# EAGLE design blinkmusb_b0 (EAGLE 5.11)
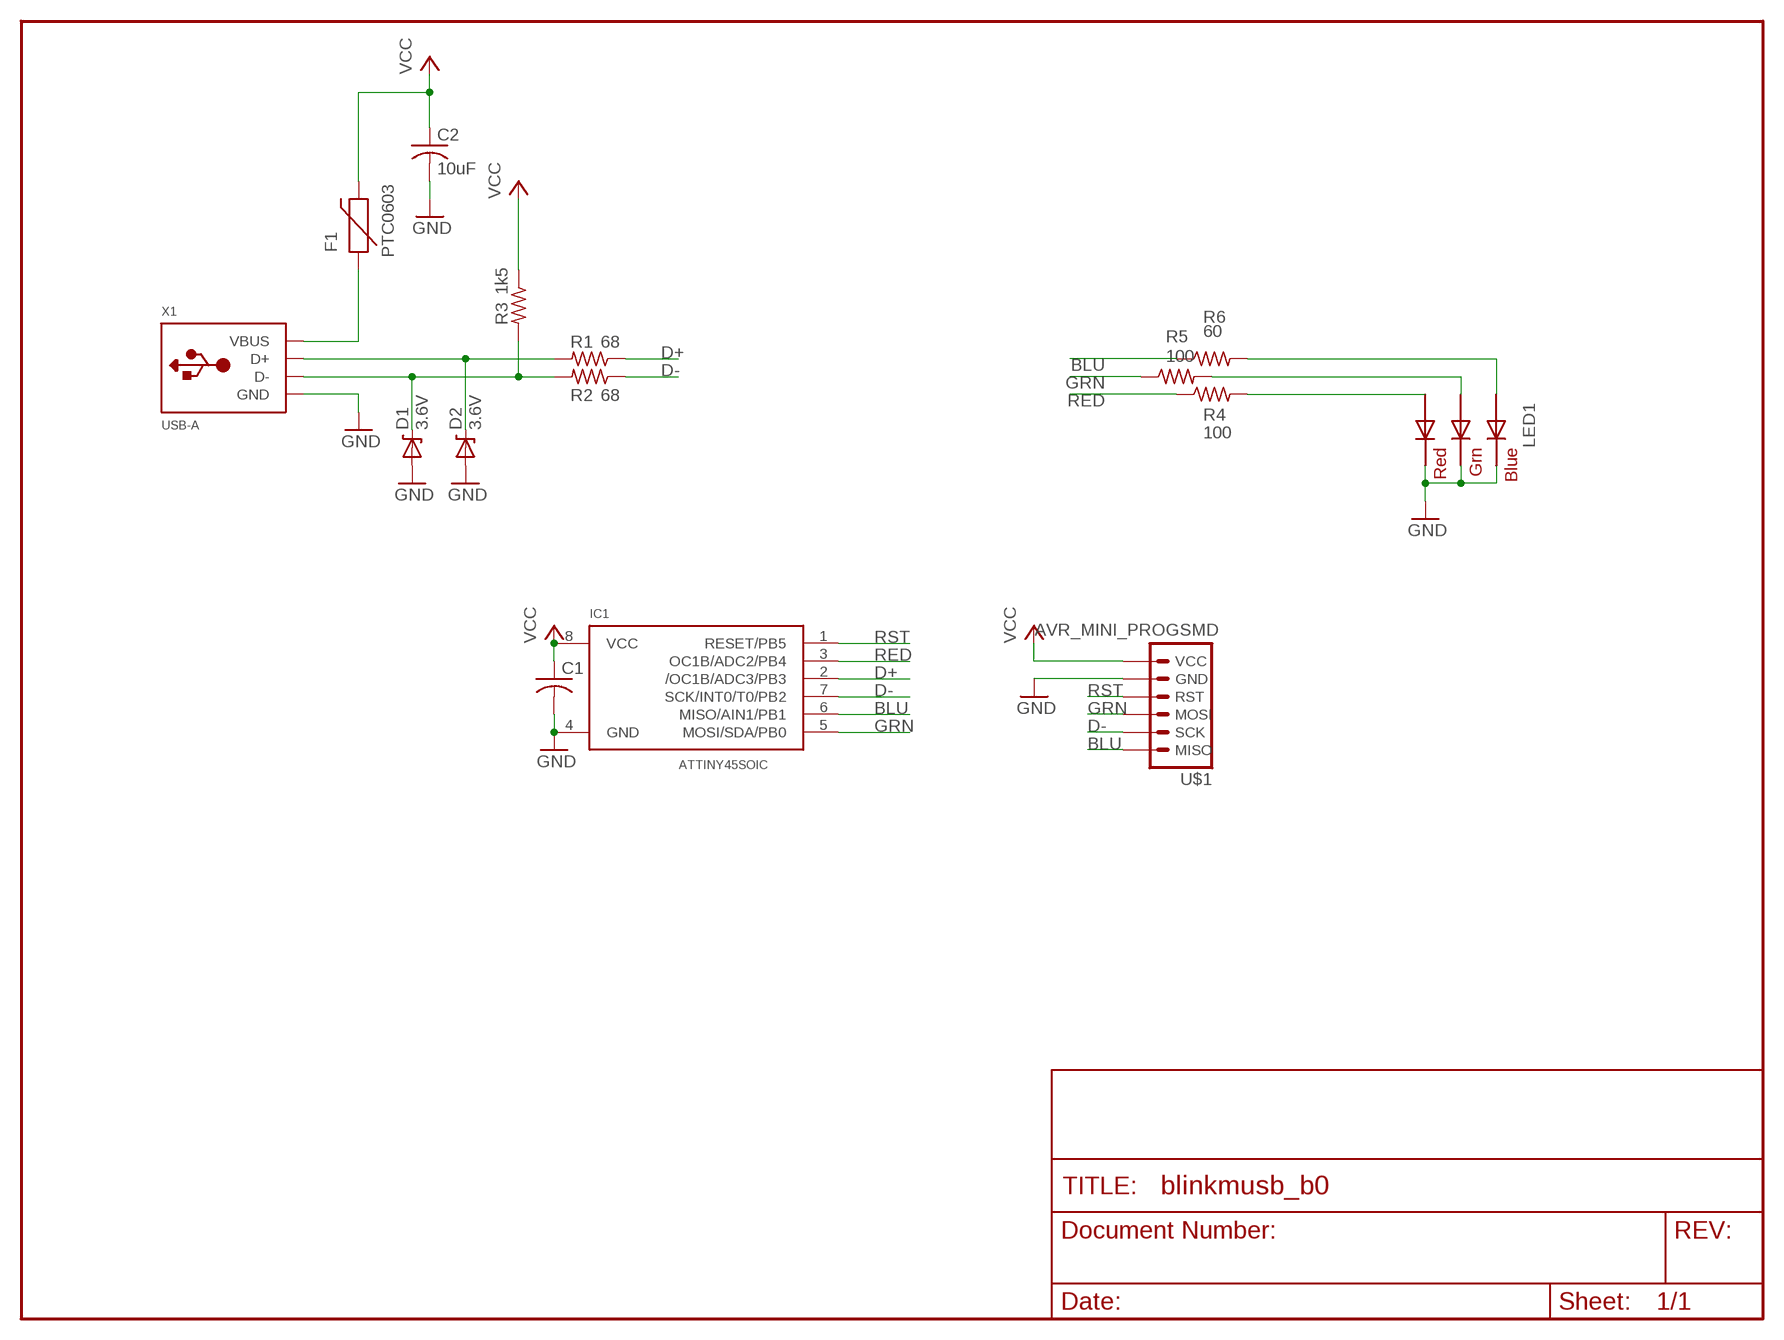
[diagram p0: schematic, sheet 1]

## Parts
C1  C-USC0603  [C0603]
C2  10uF  C-USC0603  [C0603]
D1  3.6V  DIODE-ZENER-BZT52  [SOD-323]
D2  3.6V  DIODE-ZENER-BZT52  [SOD-323]
F1  PTC0603  [0603]
IC1  ATTINY45SOIC  [SO08-EIAJ]
LED1  RGBLED5050  [RGBLED5050]
R1  68  R-US_R0603  [R0603]
R2  68  R-US_R0603  [R0603]
R3  1k5  R-US_R0603  [R0603]
R4  100  R-US_R0603  [R0603]
R5  100  R-US_R0603  [R0603]
R6  60  R-US_R0603  [R0603]
U$1  AVR_MINI_PROGSMD  [AVR_MINI_PROG]
X1  USB-A  [MOLEX_480371000]

## Nets
BLU: IC1.6(MISO/AIN1/PB1) R6.1 U$1.6(MISO)
D+: IC1.2(/OC1B/ADC3/PB3) R1.1
D-: IC1.7(SCK/INT0/T0/PB2) R2.1 U$1.5(SCK)
GND: C1.2 C2.2 D1.2(A) D2.2(A) IC1.4(GND) LED1.4(BLUE_C) LED1.5(RED_C) LED1.6(GREEN_C) U$1.2(GND) X1.4(GND)
GRN: IC1.5(MOSI/SDA/PB0) R5.1 U$1.4(MOSI)
N$4: D2.1(C) R1.2 X1.3(D+)
N$5: D1.1(C) R2.2 R3.2 X1.2(D-)
N$13: F1.1 X1.1(VBUS)
RBLU: LED1.3(BLUE_A) R6.2
RED: IC1.3(OC1B/ADC2/PB4) R4.1
RGRN: LED1.1(GREEN_A) R5.2
RRED: LED1.2(RED_A) R4.2
RST: IC1.1(RESET/PB5) U$1.3(RST)
VCC: C1.1 C2.1 F1.2 IC1.8(VCC) R3.1 U$1.1(VCC)

## Library data of the parts
C1 C2 = rcl:C-US: CAPACITOR, American symbol
D1 D2 = SparkFun-20110517:DIODE-ZENER: Zener Diode Production Part - 8199 3.4V Zener Voltage
F1 = SparkFun-20110517:PTC: Resettable Fuse PTC Resettable Fuse. Spark Fun Electronics SKU : COM-08357
IC1 = todstuff:ATTINY45
LED1 = adafruit-20120122:RGBLED: For 5050 RGB LEDs, the order of the LEDs may vary from one manufacturer to another!
R1-R6 = rcl:R-US_: RESISTOR, American symbol
U$1 = SparkFun-20110517:AVR_MINI_PROG
X1 = adafruit-20120122:USB-A: USB type A 'plug' Used for things that can directly connect to a USB port, say USB key

## Board
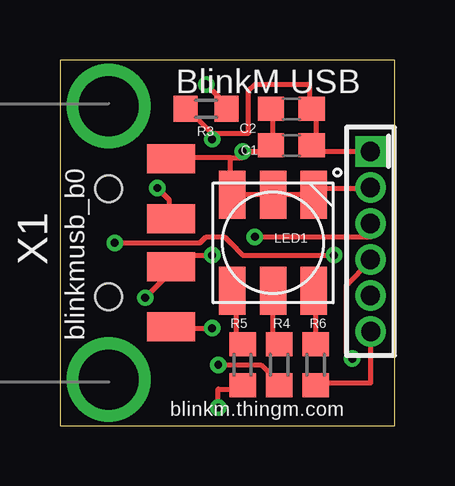
[diagram p1: board, top side]
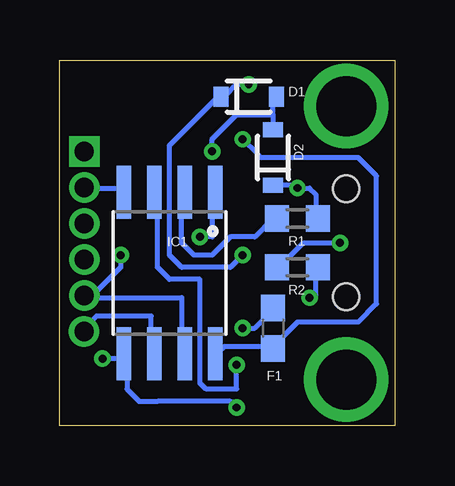
[diagram p2: board, bottom side, seen from below]

Size 13.97 x 15.24 mm. Coordinates in mm from the lower left corner, seen from the top.
Outline: 0,0 13.97,0 13.97,15.24 0,15.24 0,0
Copper layers (1*16): Top 0.0356mm / dielectric 1.5011mm / Bottom 0.0356mm
Design rules "LaenPCBOrder *": minimum track width 8mil, minimum drill 13mil, track to track 6mil, track to pad 8mil, pad to pad 8mil, via to via 8mil, smd to smd 6mil, copper to edge 15mil, drill to drill 8mil, minimum pad ring 7mil, minimum via ring 7mil, stop-mask expansion 4mil, vias tented up to drill 0mil, thermal gap 10mil

### Footprints (pad centres in the part's own frame; a part is rotated, then mirrored left to right if it is on the bottom)
C0603 = smd 1.1 x 1: 1 -0.85,0; 2 0.85,0
SOD-323 = smd 0.63 x 0.83: 1 -1.15,0; 2 1.15,0
0603 = smd 1.1 x 1: 1 -0.85,0; 2 0.85,0
SO08-EIAJ = smd 0.61 x 2.21: 1 -1.905,-3.378; 2 -0.635,-3.378; 3 0.635,-3.378; 4 1.905,-3.378; 5 1.905,3.353; 6 0.635,3.353; 7 -0.635,3.353; 8 -1.905,3.353
RGBLED5050 = smd 2 x 1.1: 1 -2,1.7; 2 -2,0; 3 -2,-1.7; 4 2,-1.7; 5 2,0; 6 2,1.7
R0603 = smd 1 x 1.1: 1 -0.85,0; 2 0.85,0
AVR_MINI_PROG = drill 0.8 pad 1.27 square: 1 0,0 | drill 0.8 pad 1.27 round: 2 1.5,0; 3 3,0; 4 4.5,0; 5 6,0; 6 7.5,0.01
MOLEX_480371000 = smd 1.2 x 2: 1 3.5,2.6; 2 1,2.6; 3 -1,2.6; 4 -3.5,2.6 | drill 2.5 round: M1 -5.7,0; M2 5.7,0 | hole 1.1: -2.25,0; 2.25,0

### Placement (x,y rotation side)
C1  9.65,11.68 180 top
C2  9.65,13.21 180 top
D1  6.1,13.72 0 bottom
D2  5.08,11.18 90 bottom
F1  5.08,4.06 270 bottom
IC1  9.4,6.35 180 bottom
LED1  8.89,7.62 90 top
R1  4.06,8.64 0 bottom
R2  4.06,6.6 0 bottom
R3  6.1,13.21 0 top
R4  9.14,2.54 90 top
R5  7.62,2.54 90 top
R6  10.67,2.54 90 top
U$1  12.95,11.43 270 top
X1  2.03,7.62 270 top

### Tracks (layer width: path | path; a pad name or v marks a point on that pad's centre or on a via)
BLU
  Top 0.203: R6.1 10.67,1.78 12.95,1.78 12.95,3.81 U$1.6
  Bottom 0.203: IC1.6 10.16,3.05 10.16,4.57 12.45,4.57 12.95,4.06 U$1.6
D+
  Bottom 0.203: R1.1 5.08,8.64 5.84,7.87 6.86,7.87 7.62,7.11 8.38,7.11 8.89,7.62 8.89,9.65 IC1.2
D-  (via drill 0.33)
  Top 0.203: v2.29,7.62 5.84,7.62 6.1,7.87 6.86,7.87 7.11,7.62 7.62,7.11 v11.43,7.11
  Bottom 0.203: v2.29,7.62 3.81,7.62 4.83,6.6 R2.1 | IC1.7 8.89,3.05 8.89,5.33 12.95,5.33 U$1.5 12.6,5.43 11.43,6.6 v11.43,7.11
GND  (via drill 0.33)
  Top 0.203: C2.2 8.89,13.21 8.89,11.68 C1.2 8.64,11.68 8.64,11.43 v7.62,11.43 7.62,11.18 7.11,11.18 | 7.11,11.18 4.83,11.18 X1.4 | 8.89,9.65 7.37,9.65 LED1.6 7.11,9.65 7.11,11.18 | 8.89,9.65 LED1.5 8.89,9.65 | 8.89,9.65 10.41,9.65 LED1.4 10.67,9.65 10.67,9.91 12.95,9.91 U$1.2
  Bottom 0.203: 5.08,12.95 5.08,13.72 D1.2 | 5.08,12.95 5.08,12.19 D2.2 | v7.62,11.43 7.62,11.68 7.62,11.94 6.6,12.95 5.08,12.95 | IC1.4 11.43,9.91 12.95,9.91 U$1.2
GRN  (via drill 0.33)
  Top 0.203: v6.6,0.76 6.6,1.52 7.62,1.52 R5.1 | v12.19,2.79 11.94,3.05 11.94,5.84 12.95,6.86 U$1.4
  Bottom 0.203: v6.6,0.76 6.86,1.02 9.91,1.02 10.67,1.02 11.18,1.52 11.18,2.29 11.18,2.79 IC1.5 11.43,2.79 v12.19,2.79
N$4  (via drill 0.33)
  Top 0.203: v4.06,9.91 4.57,9.4 4.57,8.64 X1.3
  Bottom 0.203: R1.2 3.3,8.64 3.3,9.65 3.56,9.91 v4.06,9.91 4.18,10.03 D2.1
N$5  (via drill 0.33)
  Top 0.203: v6.1,14.22 6.86,13.46 6.86,13.21 R3.2 | v3.56,5.33 4.57,6.35 4.57,6.6 X1.2 4.83,6.86 4.83,7.11 v6.35,7.11
  Bottom 0.203: v6.1,14.22 6.6,14.22 7.11,13.72 D1.1 7.37,13.72 9.4,11.68 9.4,7.11 8.89,6.6 6.86,6.6 v6.35,7.11 | v3.56,5.33 3.3,5.33 3.3,6.6 R2.2
N$13  (via drill 0.33)
  Top 0.203: v6.35,4.06 4.83,4.06 X1.1
  Bottom 0.203: v6.35,4.06 5.84,4.06 5.08,4.83 F1.1
RBLU
  Top 0.203: R6.2 10.67,3.56 10.67,5.59 LED1.3
RED  (via drill 0.33)
  Top 0.203: v6.6,2.54 8.38,2.54 9.14,1.78 R4.1
  Bottom 0.203: v6.6,2.54 6.6,1.52 7.87,1.52 8.13,1.78 8.13,6.1 9.4,6.1 9.91,6.6 9.91,9.65 IC1.3
RGRN
  Top 0.203: R5.2 7.62,3.56 7.37,3.81 7.37,5.59 LED1.1
RRED
  Top 0.203: R4.2 9.14,3.56 8.89,3.81 8.89,5.59 LED1.2
RST  (via drill 0.33)
  Top 0.203: v8.13,7.87 12.95,7.87 12.95,8.38 U$1.3
  Bottom 0.203: v8.13,7.87 7.62,7.87 7.62,9.65 IC1.1
VCC  (via drill 0.33)
  Top 0.203: 6.35,12.19 5.33,13.21 R3.1 | 6.35,12.19 7.87,12.19 7.87,13.97 8.13,14.22 10.41,14.22 10.41,13.21 C2.1 10.67,13.21 10.67,11.68 | 10.67,11.68 C1.1 10.67,11.68 | U$1.1 10.67,11.43 10.67,11.68 | v6.35,11.94 6.35,12.19
  Bottom 0.203: 5.08,3.3 7.11,3.3 7.37,3.05 IC1.8 | 5.08,3.3 F1.2 5.08,3.3 | 5.08,3.3 4.06,4.32 1.52,4.32 0.76,5.08 0.76,10.41 1.52,11.18 5.59,11.18 | 5.71,11.3 v6.35,11.94 | 5.59,11.18 5.71,11.3 | 5.59,11.18 5.71,11.3

### Text on the board
tPlace: BlinkM USB | blinkmusb_b0 | blinkm.thingm.com